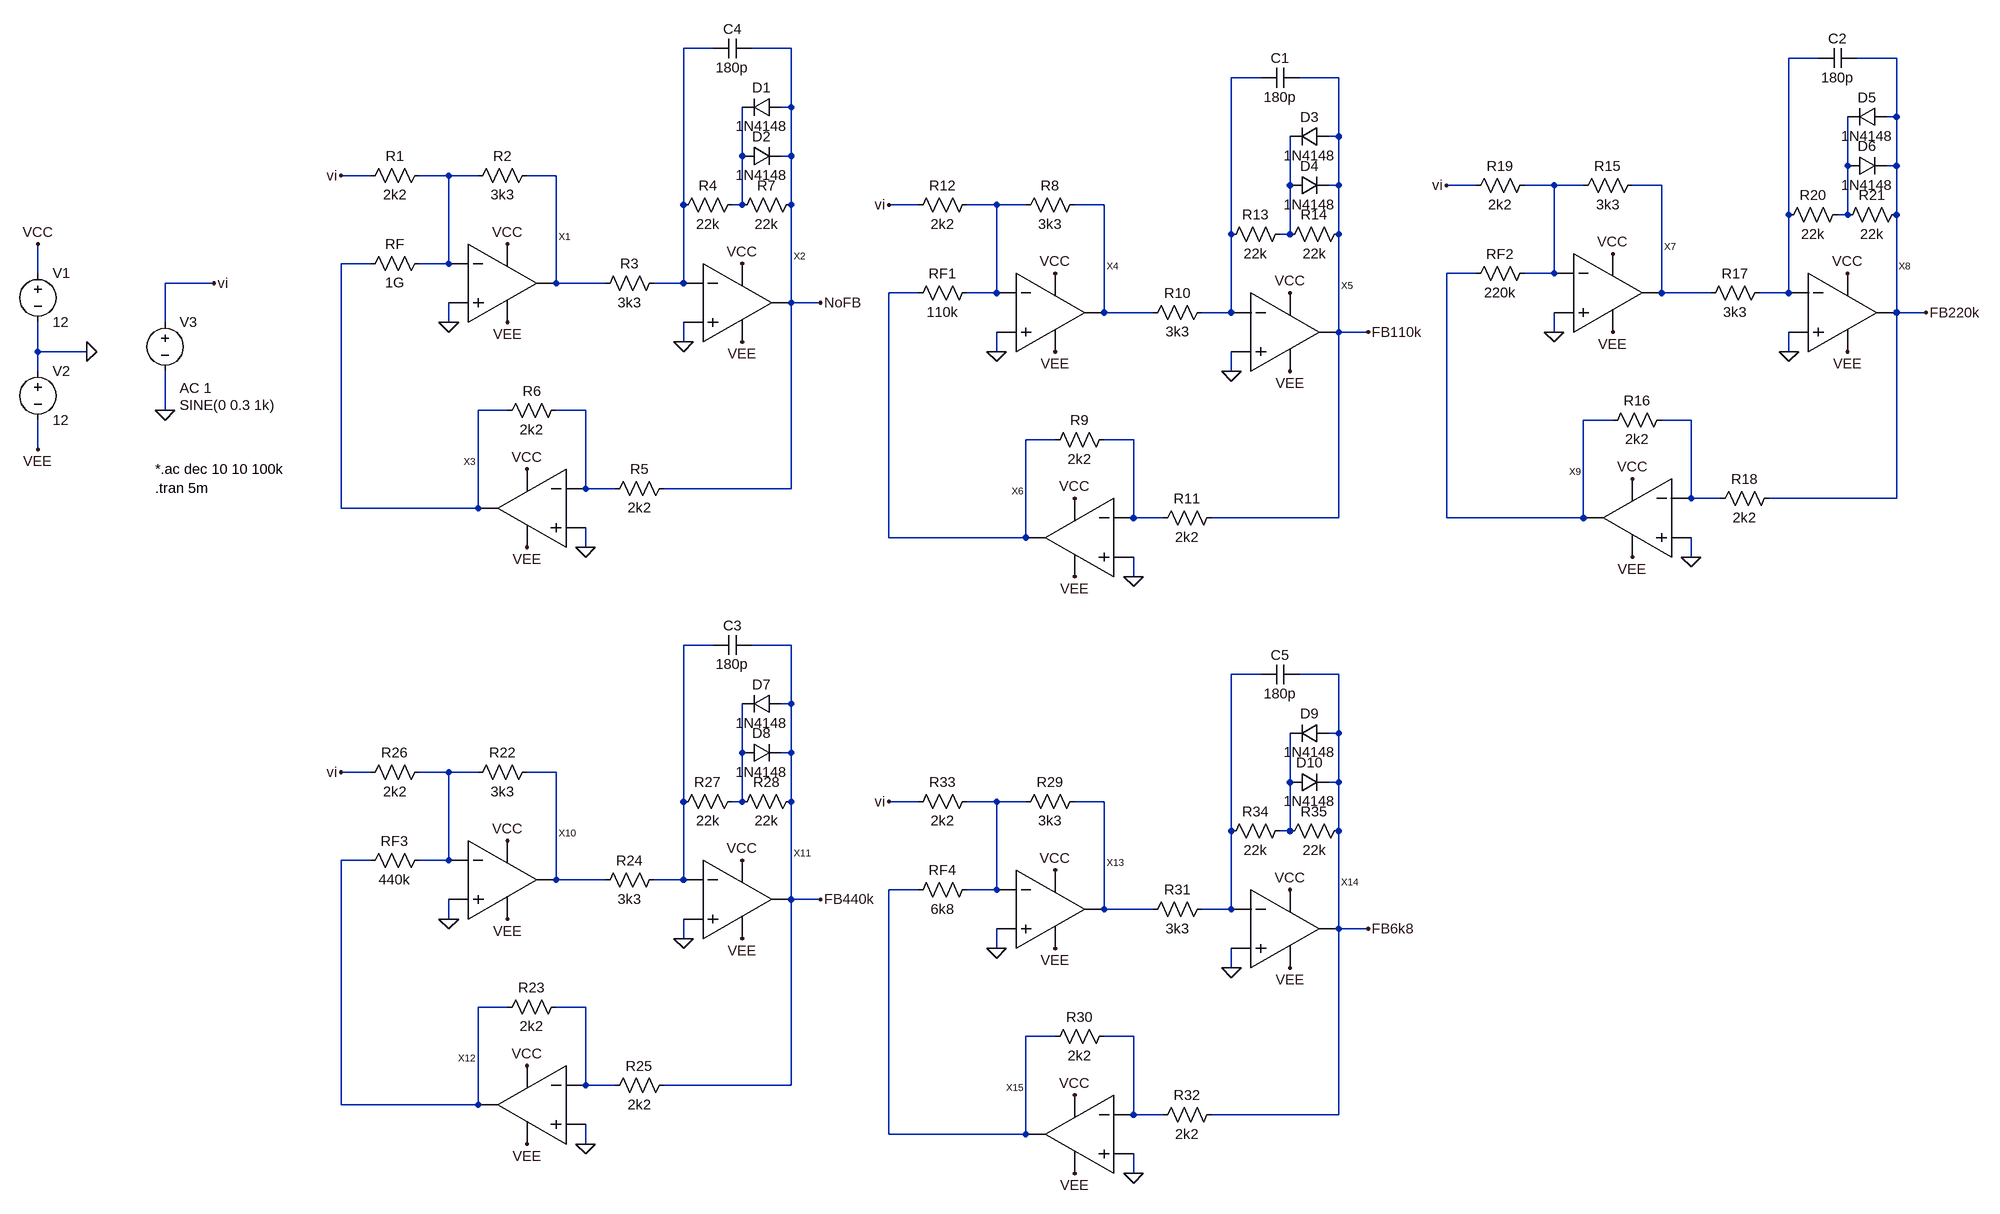
[diagram p0: schematic Perc-02-03-gabung.asc]
Perc-02-03-gabung.asc, the LTspice schematic file:
Version 4
SHEET 1 3208 1592
WIRE 1120 -336 1072 -336
WIRE 1248 -336 1184 -336
WIRE 2928 -320 2880 -320
WIRE 3056 -320 2992 -320
WIRE 2016 -288 1968 -288
WIRE 2144 -288 2080 -288
WIRE 1248 -240 1248 -336
WIRE 1248 -240 1232 -240
WIRE 3056 -224 3056 -320
WIRE 3056 -224 3040 -224
WIRE 2144 -192 2144 -288
WIRE 2144 -192 2128 -192
WIRE 1168 -160 1168 -240
WIRE 1248 -160 1248 -240
WIRE 1248 -160 1232 -160
WIRE 2976 -144 2976 -224
WIRE 3056 -144 3056 -224
WIRE 3056 -144 3040 -144
WIRE 560 -128 512 -128
WIRE 688 -128 640 -128
WIRE 736 -128 688 -128
WIRE 864 -128 816 -128
WIRE 2064 -112 2064 -192
WIRE 2144 -112 2144 -192
WIRE 2144 -112 2128 -112
WIRE 2368 -112 2320 -112
WIRE 2496 -112 2448 -112
WIRE 2544 -112 2496 -112
WIRE 2672 -112 2624 -112
WIRE 1072 -80 1072 -336
WIRE 1168 -80 1168 -160
WIRE 1168 -80 1152 -80
WIRE 1248 -80 1248 -160
WIRE 1456 -80 1408 -80
WIRE 1584 -80 1536 -80
WIRE 1632 -80 1584 -80
WIRE 1760 -80 1712 -80
WIRE 2880 -64 2880 -320
WIRE 2976 -64 2976 -144
WIRE 2976 -64 2960 -64
WIRE 3056 -64 3056 -144
WIRE 1968 -32 1968 -288
WIRE 2064 -32 2064 -112
WIRE 2064 -32 2048 -32
WIRE 2144 -32 2144 -112
WIRE 560 16 512 16
WIRE 688 16 688 -128
WIRE 688 16 640 16
WIRE 16 32 16 -16
WIRE 2368 32 2320 32
WIRE 2496 32 2496 -112
WIRE 2496 32 2448 32
WIRE 304 48 224 48
WIRE 864 48 864 -128
WIRE 944 48 864 48
WIRE 1072 48 1072 -80
WIRE 1072 48 1024 48
WIRE 1456 64 1408 64
WIRE 1584 64 1584 -80
WIRE 1584 64 1536 64
WIRE 2672 64 2672 -112
WIRE 2752 64 2672 64
WIRE 2880 64 2880 -64
WIRE 2880 64 2832 64
WIRE 1248 80 1248 -80
WIRE 1248 80 1232 80
WIRE 1296 80 1248 80
WIRE 1760 96 1760 -80
WIRE 1840 96 1760 96
WIRE 1968 96 1968 -32
WIRE 1968 96 1920 96
WIRE 3056 96 3056 -64
WIRE 3056 96 3040 96
WIRE 3104 96 3056 96
WIRE 224 112 224 48
WIRE 688 112 688 80
WIRE 2144 128 2144 -32
WIRE 2144 128 2128 128
WIRE 2192 128 2144 128
WIRE 2496 128 2496 96
WIRE 1072 144 1072 112
WIRE 16 160 16 112
WIRE 96 160 16 160
WIRE 1584 160 1584 128
WIRE 2880 160 2880 128
WIRE 16 192 16 160
WIRE 1968 192 1968 160
WIRE 224 256 224 192
WIRE 784 256 736 256
WIRE 912 256 864 256
WIRE 2592 272 2544 272
WIRE 2720 272 2672 272
WIRE 1680 304 1632 304
WIRE 1808 304 1760 304
WIRE 16 320 16 272
WIRE 912 384 912 256
WIRE 960 384 912 384
WIRE 1248 384 1248 80
WIRE 1248 384 1040 384
WIRE 2720 400 2720 272
WIRE 2768 400 2720 400
WIRE 3056 400 3056 96
WIRE 3056 400 2848 400
WIRE 512 416 512 16
WIRE 736 416 736 256
WIRE 736 416 512 416
WIRE 1808 432 1808 304
WIRE 1856 432 1808 432
WIRE 2144 432 2144 128
WIRE 2144 432 1936 432
WIRE 2320 432 2320 32
WIRE 2544 432 2544 272
WIRE 2544 432 2320 432
WIRE 1408 464 1408 64
WIRE 1632 464 1632 304
WIRE 1632 464 1408 464
WIRE 912 480 912 448
WIRE 2720 496 2720 464
WIRE 1808 528 1808 496
WIRE 1120 640 1072 640
WIRE 1248 640 1184 640
WIRE 2016 688 1968 688
WIRE 2144 688 2080 688
WIRE 1248 736 1248 640
WIRE 1248 736 1232 736
WIRE 2144 784 2144 688
WIRE 2144 784 2128 784
WIRE 1168 816 1168 736
WIRE 1248 816 1248 736
WIRE 1248 816 1232 816
WIRE 560 848 512 848
WIRE 688 848 640 848
WIRE 736 848 688 848
WIRE 864 848 816 848
WIRE 2064 864 2064 784
WIRE 2144 864 2144 784
WIRE 2144 864 2128 864
WIRE 1072 896 1072 640
WIRE 1168 896 1168 816
WIRE 1168 896 1152 896
WIRE 1248 896 1248 816
WIRE 1456 896 1408 896
WIRE 1584 896 1536 896
WIRE 1632 896 1584 896
WIRE 1760 896 1712 896
WIRE 1968 944 1968 688
WIRE 2064 944 2064 864
WIRE 2064 944 2048 944
WIRE 2144 944 2144 864
WIRE 560 992 512 992
WIRE 688 992 688 848
WIRE 688 992 640 992
WIRE 864 1024 864 848
WIRE 944 1024 864 1024
WIRE 1072 1024 1072 896
WIRE 1072 1024 1024 1024
WIRE 1456 1040 1408 1040
WIRE 1584 1040 1584 896
WIRE 1584 1040 1536 1040
WIRE 1248 1056 1248 896
WIRE 1248 1056 1232 1056
WIRE 1296 1056 1248 1056
WIRE 1760 1072 1760 896
WIRE 1840 1072 1760 1072
WIRE 1968 1072 1968 944
WIRE 1968 1072 1920 1072
WIRE 688 1088 688 1056
WIRE 2144 1104 2144 944
WIRE 2144 1104 2128 1104
WIRE 2192 1104 2144 1104
WIRE 1072 1120 1072 1088
WIRE 1584 1136 1584 1104
WIRE 1968 1168 1968 1136
WIRE 784 1232 736 1232
WIRE 912 1232 864 1232
WIRE 1680 1280 1632 1280
WIRE 1808 1280 1760 1280
WIRE 912 1360 912 1232
WIRE 960 1360 912 1360
WIRE 1248 1360 1248 1056
WIRE 1248 1360 1040 1360
WIRE 512 1392 512 992
WIRE 736 1392 736 1232
WIRE 736 1392 512 1392
WIRE 1808 1408 1808 1280
WIRE 1856 1408 1808 1408
WIRE 2144 1408 2144 1104
WIRE 2144 1408 1936 1408
WIRE 1408 1440 1408 1040
WIRE 1632 1440 1632 1280
WIRE 1632 1440 1408 1440
WIRE 912 1456 912 1424
WIRE 1808 1504 1808 1472
FLAG 16 -16 VCC
FLAG 16 320 VEE
FLAG 96 160 0
FLAG 784 -16 VCC
FLAG 1168 16 VCC
FLAG 816 352 VCC
FLAG 816 480 VEE
FLAG 784 112 VEE
FLAG 1168 144 VEE
FLAG 688 112 0
FLAG 1072 144 0
FLAG 912 480 0
FLAG 1296 80 NoFB
FLAG 512 -128 vi
FLAG 304 48 vi
FLAG 224 256 0
FLAG 1680 32 VCC
FLAG 2064 64 VCC
FLAG 1712 400 VCC
FLAG 1712 528 VEE
FLAG 1680 160 VEE
FLAG 2064 192 VEE
FLAG 1584 160 0
FLAG 1968 192 0
FLAG 1808 528 0
FLAG 2192 128 FB110k
FLAG 1408 -80 vi
FLAG 2592 0 VCC
FLAG 2976 32 VCC
FLAG 2624 368 VCC
FLAG 2624 496 VEE
FLAG 2592 128 VEE
FLAG 2976 160 VEE
FLAG 2496 128 0
FLAG 2880 160 0
FLAG 2720 496 0
FLAG 3104 96 FB220k
FLAG 2320 -112 vi
FLAG 784 960 VCC
FLAG 1168 992 VCC
FLAG 816 1328 VCC
FLAG 816 1456 VEE
FLAG 784 1088 VEE
FLAG 1168 1120 VEE
FLAG 688 1088 0
FLAG 1072 1120 0
FLAG 912 1456 0
FLAG 1296 1056 FB440k
FLAG 512 848 vi
FLAG 1680 1008 VCC
FLAG 2064 1040 VCC
FLAG 1712 1376 VCC
FLAG 1712 1504 VEE
FLAG 1680 1136 VEE
FLAG 2064 1168 VEE
FLAG 1584 1136 0
FLAG 1968 1168 0
FLAG 1808 1504 0
FLAG 2192 1104 FB6k8
FLAG 1408 896 vi
SYMBOL voltage 16 16 R0
SYMATTR InstName V1
SYMATTR Value 12
SYMBOL voltage 16 176 R0
SYMATTR InstName V2
SYMATTR Value 12
SYMBOL Opampku 768 48 R0
SYMATTR InstName X1
SYMBOL Opampku 1152 80 R0
SYMATTR InstName X2
SYMBOL Opampku 832 416 M0
SYMATTR InstName X3
SYMBOL res 832 -144 R90
WINDOW 0 0 56 VBottom 2
WINDOW 3 32 56 VTop 2
SYMATTR InstName R2
SYMATTR Value 3k3
SYMBOL res 880 240 R90
WINDOW 0 0 56 VBottom 2
WINDOW 3 32 56 VTop 2
SYMATTR InstName R6
SYMATTR Value 2k2
SYMBOL res 656 0 R90
WINDOW 0 0 56 VBottom 2
WINDOW 3 32 56 VTop 2
SYMATTR InstName RF
SYMATTR Value 1G
SYMBOL res 1040 32 R90
WINDOW 0 0 56 VBottom 2
WINDOW 3 32 56 VTop 2
SYMATTR InstName R3
SYMATTR Value 3k3
SYMBOL res 1056 368 R90
WINDOW 0 0 56 VBottom 2
WINDOW 3 32 56 VTop 2
SYMATTR InstName R5
SYMATTR Value 2k2
SYMBOL res 656 -144 R90
WINDOW 0 0 56 VBottom 2
WINDOW 3 32 56 VTop 2
SYMATTR InstName R1
SYMATTR Value 2k2
SYMBOL cap 1184 -352 R90
WINDOW 0 0 32 VBottom 2
WINDOW 3 32 32 VTop 2
SYMATTR InstName C4
SYMATTR Value 180p
SYMBOL voltage 224 96 R0
WINDOW 3 24 152 Left 2
WINDOW 123 24 124 Left 2
WINDOW 39 0 0 Left 0
SYMATTR Value SINE(0 0.3 1k)
SYMATTR Value2 AC 1
SYMATTR InstName V3
SYMBOL res 1168 -96 R90
WINDOW 0 0 56 VBottom 2
WINDOW 3 32 56 VTop 2
SYMATTR InstName R4
SYMATTR Value 22k
SYMBOL res 1264 -96 R90
WINDOW 0 0 56 VBottom 2
WINDOW 3 32 56 VTop 2
SYMATTR InstName R7
SYMATTR Value 22k
SYMBOL diode 1232 -256 R90
WINDOW 0 0 32 VBottom 2
WINDOW 3 32 32 VTop 2
SYMATTR InstName D1
SYMATTR Value 1N4148
SYMBOL diode 1168 -144 R270
WINDOW 0 32 32 VTop 2
WINDOW 3 0 32 VBottom 2
SYMATTR InstName D2
SYMATTR Value 1N4148
SYMBOL Opampku 1664 96 R0
SYMATTR InstName X4
SYMBOL Opampku 2048 128 R0
SYMATTR InstName X5
SYMBOL Opampku 1728 464 M0
SYMATTR InstName X6
SYMBOL res 1728 -96 R90
WINDOW 0 0 56 VBottom 2
WINDOW 3 32 56 VTop 2
SYMATTR InstName R8
SYMATTR Value 3k3
SYMBOL res 1776 288 R90
WINDOW 0 0 56 VBottom 2
WINDOW 3 32 56 VTop 2
SYMATTR InstName R9
SYMATTR Value 2k2
SYMBOL res 1552 48 R90
WINDOW 0 0 56 VBottom 2
WINDOW 3 32 56 VTop 2
SYMATTR InstName RF1
SYMATTR Value 110k
SYMBOL res 1936 80 R90
WINDOW 0 0 56 VBottom 2
WINDOW 3 32 56 VTop 2
SYMATTR InstName R10
SYMATTR Value 3k3
SYMBOL res 1952 416 R90
WINDOW 0 0 56 VBottom 2
WINDOW 3 32 56 VTop 2
SYMATTR InstName R11
SYMATTR Value 2k2
SYMBOL res 1552 -96 R90
WINDOW 0 0 56 VBottom 2
WINDOW 3 32 56 VTop 2
SYMATTR InstName R12
SYMATTR Value 2k2
SYMBOL cap 2080 -304 R90
WINDOW 0 0 32 VBottom 2
WINDOW 3 32 32 VTop 2
SYMATTR InstName C1
SYMATTR Value 180p
SYMBOL res 2064 -48 R90
WINDOW 0 0 56 VBottom 2
WINDOW 3 32 56 VTop 2
SYMATTR InstName R13
SYMATTR Value 22k
SYMBOL res 2160 -48 R90
WINDOW 0 0 56 VBottom 2
WINDOW 3 32 56 VTop 2
SYMATTR InstName R14
SYMATTR Value 22k
SYMBOL diode 2128 -208 R90
WINDOW 0 0 32 VBottom 2
WINDOW 3 32 32 VTop 2
SYMATTR InstName D3
SYMATTR Value 1N4148
SYMBOL diode 2064 -96 R270
WINDOW 0 32 32 VTop 2
WINDOW 3 0 32 VBottom 2
SYMATTR InstName D4
SYMATTR Value 1N4148
SYMBOL Opampku 2576 64 R0
SYMATTR InstName X7
SYMBOL Opampku 2960 96 R0
SYMATTR InstName X8
SYMBOL Opampku 2640 432 M0
SYMATTR InstName X9
SYMBOL res 2640 -128 R90
WINDOW 0 0 56 VBottom 2
WINDOW 3 32 56 VTop 2
SYMATTR InstName R15
SYMATTR Value 3k3
SYMBOL res 2688 256 R90
WINDOW 0 0 56 VBottom 2
WINDOW 3 32 56 VTop 2
SYMATTR InstName R16
SYMATTR Value 2k2
SYMBOL res 2464 16 R90
WINDOW 0 0 56 VBottom 2
WINDOW 3 32 56 VTop 2
SYMATTR InstName RF2
SYMATTR Value 220k
SYMBOL res 2848 48 R90
WINDOW 0 0 56 VBottom 2
WINDOW 3 32 56 VTop 2
SYMATTR InstName R17
SYMATTR Value 3k3
SYMBOL res 2864 384 R90
WINDOW 0 0 56 VBottom 2
WINDOW 3 32 56 VTop 2
SYMATTR InstName R18
SYMATTR Value 2k2
SYMBOL res 2464 -128 R90
WINDOW 0 0 56 VBottom 2
WINDOW 3 32 56 VTop 2
SYMATTR InstName R19
SYMATTR Value 2k2
SYMBOL cap 2992 -336 R90
WINDOW 0 0 32 VBottom 2
WINDOW 3 32 32 VTop 2
SYMATTR InstName C2
SYMATTR Value 180p
SYMBOL res 2976 -80 R90
WINDOW 0 0 56 VBottom 2
WINDOW 3 32 56 VTop 2
SYMATTR InstName R20
SYMATTR Value 22k
SYMBOL res 3072 -80 R90
WINDOW 0 0 56 VBottom 2
WINDOW 3 32 56 VTop 2
SYMATTR InstName R21
SYMATTR Value 22k
SYMBOL diode 3040 -240 R90
WINDOW 0 0 32 VBottom 2
WINDOW 3 32 32 VTop 2
SYMATTR InstName D5
SYMATTR Value 1N4148
SYMBOL diode 2976 -128 R270
WINDOW 0 32 32 VTop 2
WINDOW 3 0 32 VBottom 2
SYMATTR InstName D6
SYMATTR Value 1N4148
SYMBOL Opampku 768 1024 R0
SYMATTR InstName X10
SYMBOL Opampku 1152 1056 R0
SYMATTR InstName X11
SYMBOL Opampku 832 1392 M0
SYMATTR InstName X12
SYMBOL res 832 832 R90
WINDOW 0 0 56 VBottom 2
WINDOW 3 32 56 VTop 2
SYMATTR InstName R22
SYMATTR Value 3k3
SYMBOL res 880 1216 R90
WINDOW 0 0 56 VBottom 2
WINDOW 3 32 56 VTop 2
SYMATTR InstName R23
SYMATTR Value 2k2
SYMBOL res 656 976 R90
WINDOW 0 0 56 VBottom 2
WINDOW 3 32 56 VTop 2
SYMATTR InstName RF3
SYMATTR Value 440k
SYMBOL res 1040 1008 R90
WINDOW 0 0 56 VBottom 2
WINDOW 3 32 56 VTop 2
SYMATTR InstName R24
SYMATTR Value 3k3
SYMBOL res 1056 1344 R90
WINDOW 0 0 56 VBottom 2
WINDOW 3 32 56 VTop 2
SYMATTR InstName R25
SYMATTR Value 2k2
SYMBOL res 656 832 R90
WINDOW 0 0 56 VBottom 2
WINDOW 3 32 56 VTop 2
SYMATTR InstName R26
SYMATTR Value 2k2
SYMBOL cap 1184 624 R90
WINDOW 0 0 32 VBottom 2
WINDOW 3 32 32 VTop 2
SYMATTR InstName C3
SYMATTR Value 180p
SYMBOL res 1168 880 R90
WINDOW 0 0 56 VBottom 2
WINDOW 3 32 56 VTop 2
SYMATTR InstName R27
SYMATTR Value 22k
SYMBOL res 1264 880 R90
WINDOW 0 0 56 VBottom 2
WINDOW 3 32 56 VTop 2
SYMATTR InstName R28
SYMATTR Value 22k
SYMBOL diode 1232 720 R90
WINDOW 0 0 32 VBottom 2
WINDOW 3 32 32 VTop 2
SYMATTR InstName D7
SYMATTR Value 1N4148
SYMBOL diode 1168 832 R270
WINDOW 0 32 32 VTop 2
WINDOW 3 0 32 VBottom 2
SYMATTR InstName D8
SYMATTR Value 1N4148
SYMBOL Opampku 1664 1072 R0
SYMATTR InstName X13
SYMBOL Opampku 2048 1104 R0
SYMATTR InstName X14
SYMBOL Opampku 1728 1440 M0
SYMATTR InstName X15
SYMBOL res 1728 880 R90
WINDOW 0 0 56 VBottom 2
WINDOW 3 32 56 VTop 2
SYMATTR InstName R29
SYMATTR Value 3k3
SYMBOL res 1776 1264 R90
WINDOW 0 0 56 VBottom 2
WINDOW 3 32 56 VTop 2
SYMATTR InstName R30
SYMATTR Value 2k2
SYMBOL res 1552 1024 R90
WINDOW 0 0 56 VBottom 2
WINDOW 3 32 56 VTop 2
SYMATTR InstName RF4
SYMATTR Value 6k8
SYMBOL res 1936 1056 R90
WINDOW 0 0 56 VBottom 2
WINDOW 3 32 56 VTop 2
SYMATTR InstName R31
SYMATTR Value 3k3
SYMBOL res 1952 1392 R90
WINDOW 0 0 56 VBottom 2
WINDOW 3 32 56 VTop 2
SYMATTR InstName R32
SYMATTR Value 2k2
SYMBOL res 1552 880 R90
WINDOW 0 0 56 VBottom 2
WINDOW 3 32 56 VTop 2
SYMATTR InstName R33
SYMATTR Value 2k2
SYMBOL cap 2080 672 R90
WINDOW 0 0 32 VBottom 2
WINDOW 3 32 32 VTop 2
SYMATTR InstName C5
SYMATTR Value 180p
SYMBOL res 2064 928 R90
WINDOW 0 0 56 VBottom 2
WINDOW 3 32 56 VTop 2
SYMATTR InstName R34
SYMATTR Value 22k
SYMBOL res 2160 928 R90
WINDOW 0 0 56 VBottom 2
WINDOW 3 32 56 VTop 2
SYMATTR InstName R35
SYMATTR Value 22k
SYMBOL diode 2128 768 R90
WINDOW 0 0 32 VBottom 2
WINDOW 3 32 32 VTop 2
SYMATTR InstName D9
SYMATTR Value 1N4148
SYMBOL diode 2064 880 R270
WINDOW 0 32 32 VTop 2
WINDOW 3 0 32 VBottom 2
SYMATTR InstName D10
SYMATTR Value 1N4148
TEXT 208 352 Left 2 !*.ac dec 10 10 100k\n.tran 5m

The netlist it stands for:
* Perc-02-03-gabung.asc
V1 VCC 0 12
V2 0 VEE 12
XX1 N006 0 VCC VEE N007 Opampku  ; pins inn inp vp vn out
XX2 N001 0 VCC VEE NoFB Opampku  ; pins inn inp vp vn out
XX3 N016 0 VCC VEE N013 Opampku  ; pins inn inp vp vn out
R2 N007 N006 3k3
R6 N016 N013 2k2
RF N006 N013 1G
R3 N001 N007 3k3
R5 NoFB N016 2k2
R1 N006 vi 2k2
C4 NoFB N001 180p
V3 vi 0 SINE(0 0.3 1k) AC 1
R4 N004 N001 22k
R7 NoFB N004 22k
D1 NoFB N004 1N4148
D2 N004 NoFB 1N4148
XX4 N011 0 VCC VEE N012 Opampku  ; pins inn inp vp vn out
XX5 N003 0 VCC VEE FB110k Opampku  ; pins inn inp vp vn out
XX6 N018 0 VCC VEE N015 Opampku  ; pins inn inp vp vn out
R8 N012 N011 3k3
R9 N018 N015 2k2
RF1 N011 N015 110k
R10 N003 N012 3k3
R11 FB110k N018 2k2
R12 N011 vi 2k2
C1 FB110k N003 180p
R13 N008 N003 22k
R14 FB110k N008 22k
D3 FB110k N008 1N4148
D4 N008 FB110k 1N4148
XX7 N009 0 VCC VEE N010 Opampku  ; pins inn inp vp vn out
XX8 N002 0 VCC VEE FB220k Opampku  ; pins inn inp vp vn out
XX9 N017 0 VCC VEE N014 Opampku  ; pins inn inp vp vn out
R15 N010 N009 3k3
R16 N017 N014 2k2
RF2 N009 N014 220k
R17 N002 N010 3k3
R18 FB220k N017 2k2
R19 N009 vi 2k2
C2 FB220k N002 180p
R20 N005 N002 22k
R21 FB220k N005 22k
D5 FB220k N005 1N4148
D6 N005 FB220k 1N4148
XX10 N022 0 VCC VEE N023 Opampku  ; pins inn inp vp vn out
XX11 N019 0 VCC VEE FB440k Opampku  ; pins inn inp vp vn out
XX12 N029 0 VCC VEE N027 Opampku  ; pins inn inp vp vn out
R22 N023 N022 3k3
R23 N029 N027 2k2
RF3 N022 N027 440k
R24 N019 N023 3k3
R25 FB440k N029 2k2
R26 N022 vi 2k2
C3 FB440k N019 180p
R27 N021 N019 22k
R28 FB440k N021 22k
D7 FB440k N021 1N4148
D8 N021 FB440k 1N4148
XX13 N025 0 VCC VEE N026 Opampku  ; pins inn inp vp vn out
XX14 N020 0 VCC VEE FB6k8 Opampku  ; pins inn inp vp vn out
XX15 N030 0 VCC VEE N028 Opampku  ; pins inn inp vp vn out
R29 N026 N025 3k3
R30 N030 N028 2k2
RF4 N025 N028 6k8
R31 N020 N026 3k3
R32 FB6k8 N030 2k2
R33 N025 vi 2k2
C5 FB6k8 N020 180p
R34 N024 N020 22k
R35 FB6k8 N024 22k
D9 FB6k8 N024 1N4148
D10 N024 FB6k8 1N4148
.model D D
.lib standard.dio
*.ac dec 10 10 100k
.tran 5m
.backanno
.end